# EasyEDA schematic SCH_Universal Traveler-v0.1_2022-03-10.json
TITLE: Universal Traveler; REV: 0.1; Date: 2022-03-10; Sheet: 1/1; Drawn By: Andrew Jensen; Company: Andrew Jensen
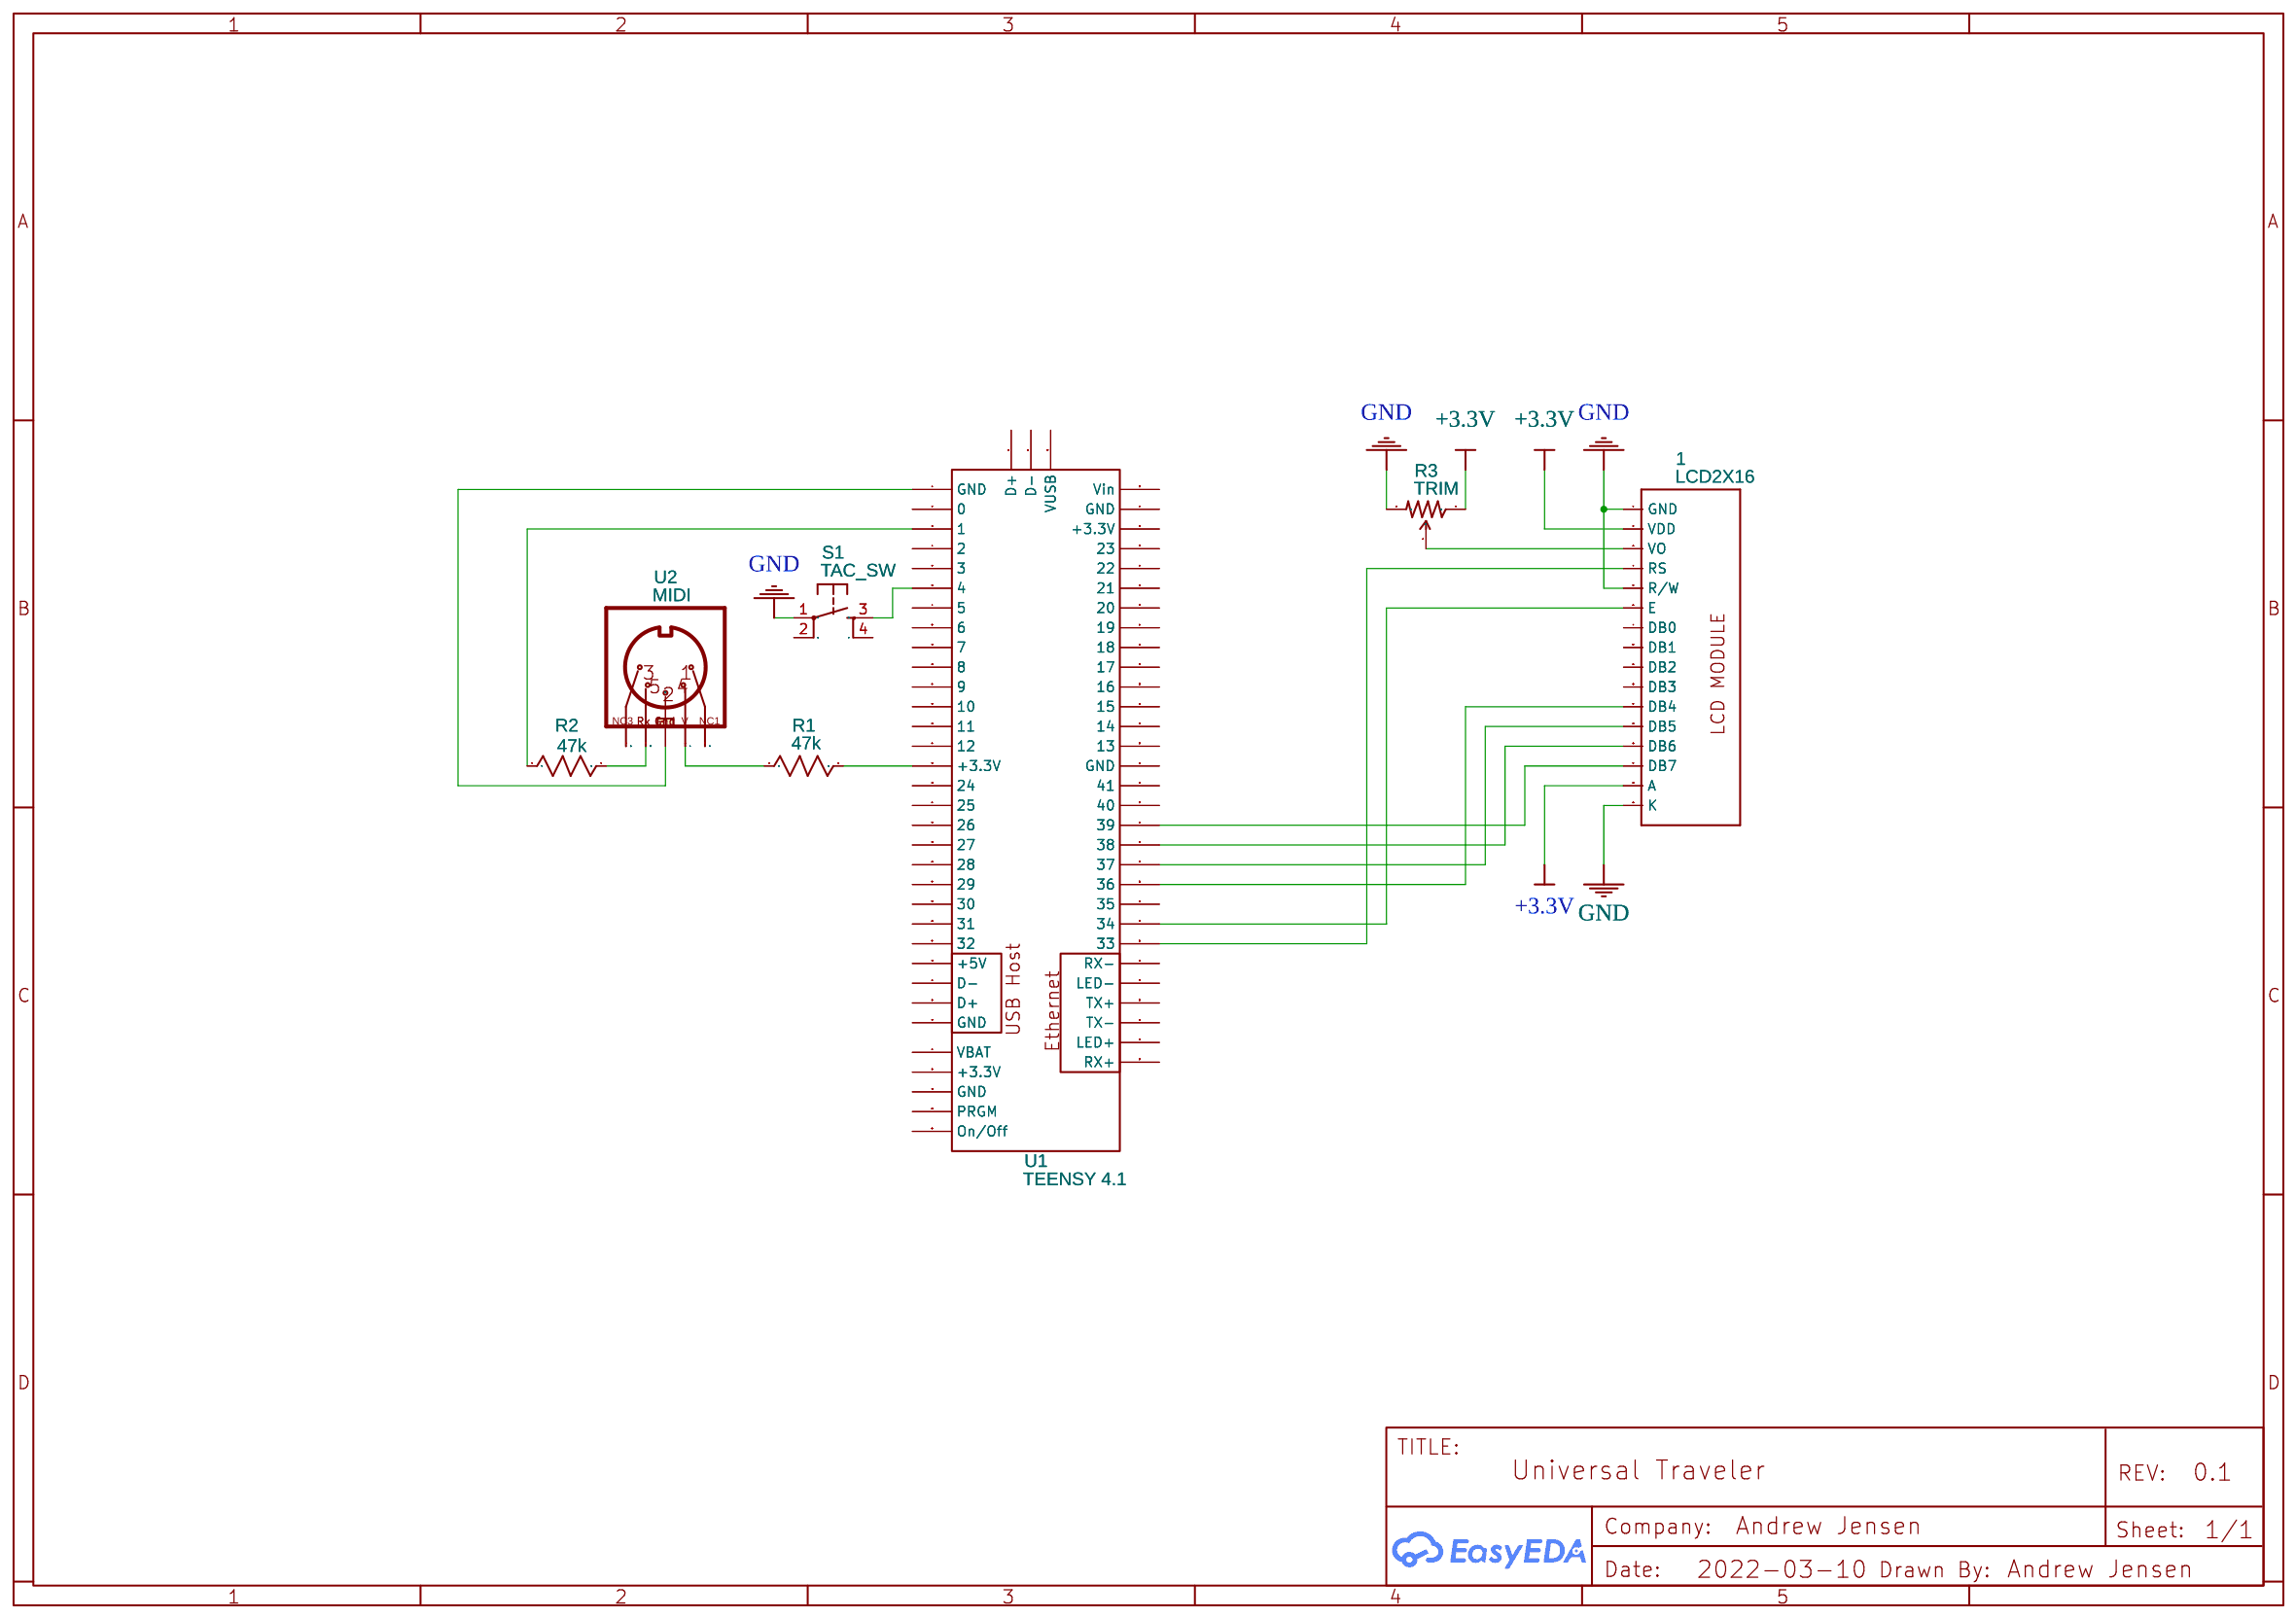
[diagram p0: schematic sheet]

## Parts
1  LCD2X16  [LCD-16X2]
R1  47k  [R0603]
R2  47k  [R0603]
R3  TRIM  [SPARKFUN_TRIM_POT_PTH]
S1  TAC_SW  [TACTILE-PTH]
U1  TEENSY 4.1  [TEENSY-4.1-ALL-PINS]
U2  MIDI  [MIDI 5 PIN]

## Library data of the parts
1 = LCD2X16: Contributor: Joerg Christian Alda
R1 R2 = R_0603_US: Contributor: LCEDA_Lib
R3 = SPARKFUN_TRIMPOTPTH: Contributor: moisesesc
S1 = TAC_SWITCHPTH: Contributor: Aelita Sophie
U1 = TEENSY 4.1 (ALL PINS): Contributor: purpleprawn
U2 = MIDI Connector_1: Contributor: haplo88

## Nets
+3.3V: 1.2(VDD) 1.15(A) R3.1(CCW)
GND: 1.1(GND) 1.5(R/W) 1.16(K) R3.3(CW) S1.1
Net-(1-3): 1.3(VO) R3.2(WIPER)
Net-(1-4): 1.4(RS) U1.25(33)
Net-(1-6): 1.6(E) U1.26(34)
Net-(1-11): 1.11(DB4) U1.28(36)
Net-(1-12): 1.12(DB5) U1.29(37)
Net-(1-13): 1.13(DB6) U1.30(38)
Net-(1-14): 1.14(DB7) U1.31(39)
Net-(R1-1): R1.1 U2.4
Net-(R1-2): R1.2 U1.15(+3.3V)
Net-(R2-1): R2.1 U1.3(1)
Net-(R2-2): R2.2 U2.5
Net-(S1-3): S1.3 U1.6(4)
Net-(U1-1): U1.1(GND) U2.2

Not connected (* = marked no-connect by the designer): 1 7(DB0) 8(DB1) 9(DB2) 10(DB3); S1 2 4; U1 2(0) 4(2) 5(3) 7(5) 8(6) 9(7) 10(8) 11(9) 12(10) 13(11) 14(12) 16(24) 17(25) 18(26) 19(27) 20(28) 21(29) 22(30) 23(31) 24(32) 27(35) 32(40) 33(41) 34(GND) 35(13) 36(14) 37(15) 38(16) 39(17) 40(18) 41(19) 42(GND) 43(D+) 44(D-) 45(+5V) 46(+3.3V) 47(VBAT) 48(+3.3V) 49(GND) 50(PRGM) 51(On/Off) 52(VUSB) 60(RX+) 61(LED+) 62(TX-) 63(TX+) 64(LED-) 65(RX-) 66(D+) 67(D-); U2 1 3
